# Altium schematic sheet TOP - NAATOS INLAY.SchDoc
size A; Revision: 8; SheetNumber: 1; SheetTotal: 7
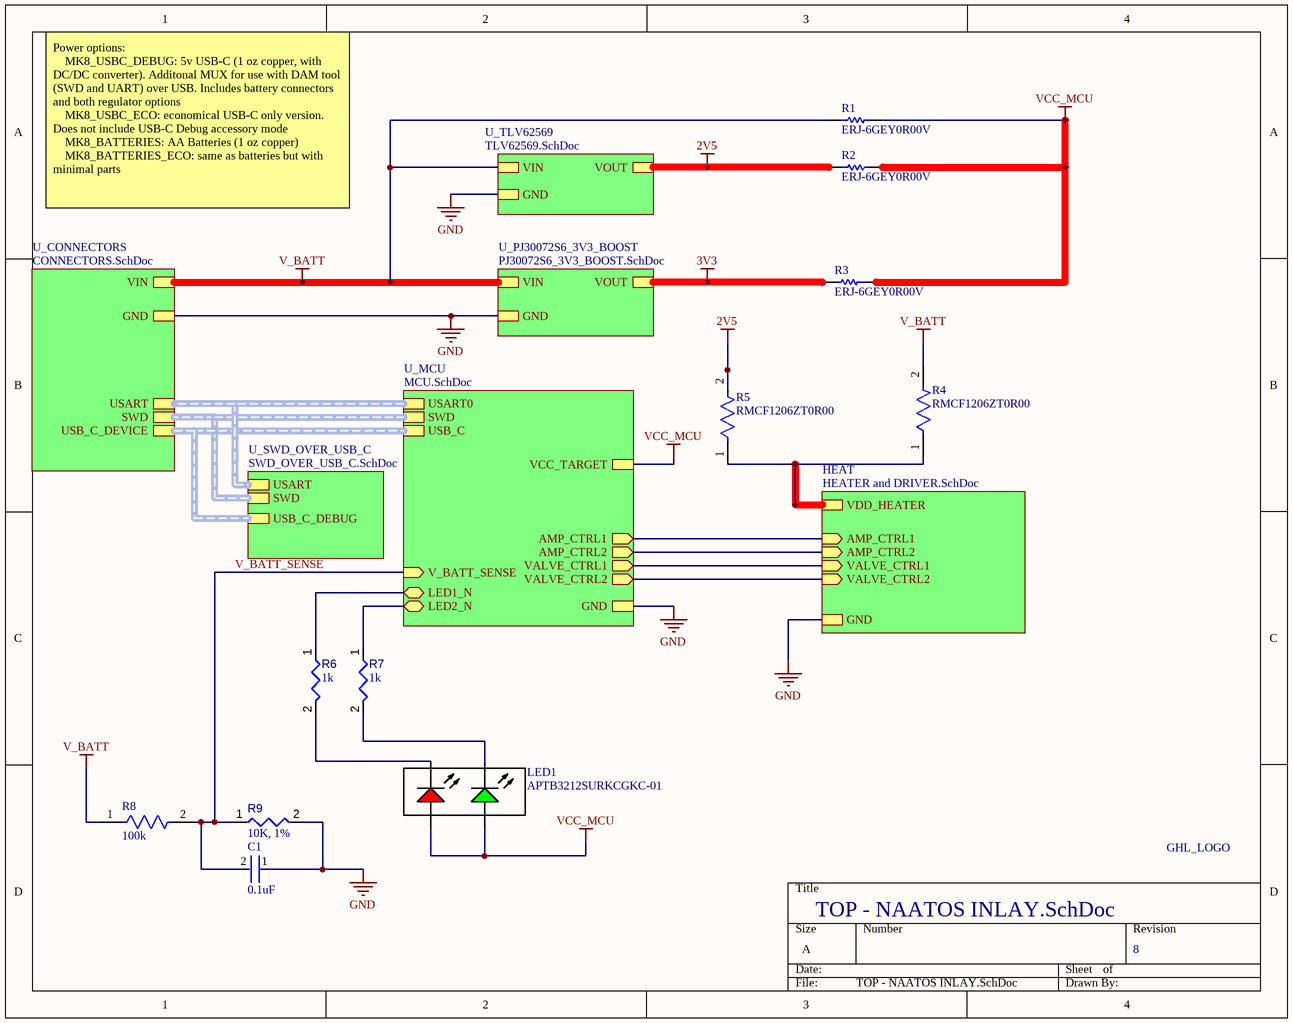
[diagram p0: TOP - NAATOS INLAY.SchDoc]

## Parts
C1  0.1uF  [FP-CL17-IPC_C]
LED1  APTB3212SURKCGKC-01  [APTB3212SURKCGKC-01]
LOGO1  GHL_LOGO  [GHLABS_LOGO]
R1  ERJ-6GEY0R00V  [RESC2013X70X40NL20T20]
R2  ERJ-6GEY0R00V  [RESC2013X70X40NL20T20]
R3  ERJ-6GEY0R00V  [RESC2013X70X40NL20T20]
R4  RMCF1206ZT0R00  [FP-RMCF1206-MFG]
R5  RMCF1206ZT0R00  [FP-RMCF1206-MFG]
R6  value 1k  [RESC1608X55X25ML10T15]  (hidden comment: Resistor 1k +/-1% 0603 100 mW)
R7  value 1k  [RESC1608X55X25ML10T15]  (hidden comment: Resistor 1k +/-1% 0603 100 mW)
R8  Resistance: 100k  [FP-CRCW0402-e3-IPC_C]  (hidden comment: CRCW0402100KFKED)
R9  value 10K, 1%  [RESC0402(1005)_L]  (hidden comment: Resistor 10K  +/-1 % 0402 63 mW)

## Sub-sheets
HEAT = HEATER and DRIVER.SchDoc: GND, VDD_HEATER, AMP_CTRL1 (in), VALVE_CTRL1 (in), AMP_CTRL2 (in), VALVE_CTRL2 (in)
U_CONNECTORS = CONNECTORS.SchDoc: GND, USART (harness USART), VIN, USB_C_DEVICE (harness USB_C), SWD (harness SWD)
U_MCU = MCU.SchDoc: USART0 (harness USART), VCC_TARGET, GND, AMP_CTRL1 (out), AMP_CTRL2 (out), VALVE_CTRL1 (out), VALVE_CTRL2 (out), V_BATT_SENSE (in), LED1_N (bidir), LED2_N (bidir), SWD (harness SWD), USB_C (harness USB_C)
U_PJ30072S6_3V3_BOOST = PJ30072S6_3V3_BOOST.SchDoc: VIN, GND, VOUT
U_SWD_OVER_USB_C = SWD_OVER_USB_C.SchDoc: USB_C_DEBUG (harness USB_C), SWD (harness SWD), USART (harness USART)
U_TLV62569 = TLV62569.SchDoc: VOUT, VIN, GND

## Nets
2V5: R2.1 R5.2 ; sheet U_TLV62569/VOUT
3V3: R3.1 ; sheet U_PJ30072S6_3V3_BOOST/VOUT
GND: C1.1 R9.2 ; sheet HEAT/GND, sheet U_CONNECTORS/GND, sheet U_MCU/GND, sheet U_TLV62569/GND, sheet U_PJ30072S6_3V3_BOOST/GND
V_BATT: R1.1 R4.2 R8.1 ; sheet U_CONNECTORS/VIN, sheet U_TLV62569/VIN, sheet U_PJ30072S6_3V3_BOOST/VIN
VCC_MCU: LED1.2(A) LED1.3(A) R1.2 R2.2 R3.2 ; sheet U_MCU/VCC_TARGET
V_BATT_SENSE: C1.2 R8.2 R9.1 ; sheet U_MCU/V_BATT_SENSE
NetLED1_1: LED1.1(K) R6.2
NetLED1_4: LED1.4(K) R7.2
NetR4_1: R4.1 R5.1 ; sheet HEAT/VDD_HEATER
NetR6_1: R6.1 ; sheet U_MCU/LED1_N
NetR7_1: R7.1 ; sheet U_MCU/LED2_N
(unnamed): sheet HEAT/AMP_CTRL1, sheet U_MCU/AMP_CTRL1
(unnamed): sheet HEAT/VALVE_CTRL1, sheet U_MCU/VALVE_CTRL1
(unnamed): sheet HEAT/AMP_CTRL2, sheet U_MCU/AMP_CTRL2
(unnamed): sheet HEAT/VALVE_CTRL2, sheet U_MCU/VALVE_CTRL2

## Buses and harness runs
harness sheet U_CONNECTORS/SWD = sheet U_MCU/SWD = sheet U_SWD_OVER_USB_C/SWD
harness sheet U_CONNECTORS/USART = sheet U_MCU/USART0 = sheet U_SWD_OVER_USB_C/USART
harness sheet U_CONNECTORS/USB_C_DEVICE = sheet U_MCU/USB_C = sheet U_SWD_OVER_USB_C/USB_C_DEBUG

## Notes on the sheet
- Power options:
  MK8_USBC_DEBUG: 5v USB-C (1 oz copper, with DC/DC converter). Additonal MUX for use with DAM tool (SWD and UART) over USB. Includes battery connectors and both regulator options
  MK8_USBC_ECO: economical USB-C only version. Does not include USB-C Debug accessory mode
  MK8_BATTERIES: AA Batteries (1 oz copper)
  MK8_BATTERIES_ECO: same as batteries but with minimal parts

## Library data of the parts
C1 = CMP-13271-001069-1: Cap Ceramic 100nF 10V X7R ±10% SMD 0402 +125°C Paper T/R; Height: 0.5mm; Case/Package: 0402; Contact Plating: Tin; Case Code (Imperial): 0402; Capacitance: 100nF; Thickness: 0.022inch; Min Operating Temperature: -55°C; Package Quantity: 1; Length: 1mm; Max Operating Temperature: 125°C; Depth: 0.5mm; Voltage Rating: 10V; Packaging: Tape and Reel; Mount: Surface Mount; Tolerance: 10%; Width: 0.02inch; Radiation Hardening: No; Case Code (Metric): 1005; Dielectric: X7R
LED1 = APTB3212SURKCGKC-01: Dual Color LED; Manufacturer: Kingbright; Supplier: Mouser; Supplier Part Number: 604-APTB3212SURKCGKC; Manufacturer Part Number: APTB3212SURKCGKC-01; RoHS: Yes; Category: LEDs; Stock: 2181; Pricing: 1=0.59, 10=0.409, 50=0.409, 100=0.295, 500=0.243, 1000=0.226, 2000=0.222, 4000=0.195, 10000=0.18, 24000=0.173 (USD); RoHS Compliant: Yes; ComponentLink1URL: https://datasheet.ciiva.com:443/pdfs/VipMasterIC/IC/KBEC/KBEC-S-A0008946974/KBEC-S-A0008946997-1.pdf?src-supplier=IHS+Markit; ComponentLink1Description: https://datasheet.ciiva.com:443/pdfs/VipMasterIC/IC/KBEC/KBEC-S-A0008946974/KBEC-S-A0008946997-1.pdf?src-supplier=IHS+Markit; Supplier 1: Digikey; Supplier Part Number 1: 754-APTB3212SURKCGKC-01CT-ND
LOGO1 = CMP-439-000000-1: Design Item ID: GHL_LOGO; Source: GHLABS_LOGO.SchLib
R1-R3 = CMP-1665-00002-5: Chip Resistor, 0 Ohm, +/- 1%, 0.125 W, -55 to 155 degC, 0805 (2012 Metric), RoHS, Tape and Reel; Tolerance: 5%; Resistance: 0 Ohm; REACH SVHC: No SVHC; Min Operating Temperature: -55 degC; Case/Package: 0805; Packaging: Tape and Reel; Package Quantity: 5000; ComponentLink1Description: Manufacturer URL; PackageDescription: 2-Pin Surface Mount Device, Body 2 x 1.25 mm; Mounting Technology: Surface Mount; Max Operating Temperature: 155 degC; PartNumber: ERJ-6GEY0R00V; Width: 1.25 mm; RoHSCompliant: True; Height: 0.6 mm; ComponentLink1URL: http://www.panasonic.com/; ComponentLink2URL: http://industrial.panasonic.com/cdbs/www-data/pdf/RDA0000/AOA0000C84.pdf; Case Code (Imperial): 0805; DatasheetVersion: 03/2015; Length: 2 mm; Case Code (Metric): 2012; ComponentLink2Description: Datasheet; Radiation Hardening: No
R4 R5 = CMP-26527-005649-1: 0Ω ±0 0.25W 1206 Thick Film Chip Resistor AEC-Q200 compliant; Working Voltage: 200V; Power Rating: 250mW; Current Rating: 2A; Resistance: 0R; Construction: Rectangular; RoHS Compliant: Yes; Military Standard: Not; Radiation Hardening: No; Case/Package: 1206; Case Code (Imperial): 1206; Packaging: Tape and Reel; Resistor Type: Thick Film; Mount: Surface Mount; Lead Free: Lead Free; Case Code (Metric): 3216; Width: 0.063inch; Series: RMCF; Features: Automotive AEC-Q200; Number of Terminations: 2; Min Operating Temperature: -55°C; Max Power Dissipation: 250mW; Contact Plating: Tin; Length: 0.126inch; Height: 0.028inch; Technology: THICK FILM; Max Operating Temperature: 155°C; Depth: 1.6mm
R6 R7 = CMP-009-00014-4: Chip Resistor, 1 KOhm, +/-1%, 0.1 W, -55 to 155 degC, 0603 (1608 Metric); Power: 100mW; Tolerance: 1%; Voltage Rating: 50V; Max Operating Temperature: 155°C; Pins: 2; RoHS Compliant: True; Case/Package: 0603; Min Operating Temperature: -55°C; Mounting Technology: SM
R8 = CMP-2002-08123-3: RES Thick Film, 100kΩ, 1%, 0.063W, 100ppm/°C, 0402; Power Rating: 63mW; Voltage Rating (DC): 50V; Lead Free: Lead Free; Height: 0.35mm; Contact Plating: Tin; Min Operating Temperature: -55°C; Package Quantity: 10000; Case/Package: 0402; Temperature Coefficient: 100ppm/°C; Number of Terminations: 2; Packaging: Tape and Reel; Max Power Dissipation: 63mW; Case Code (Metric): 1005; Mount: Surface Mount; Width: 0.02inch; Termination: SMD/SMT; Length: 1mm; Number of Pins: 2; Weight: 2.3E-05oz; Radiation Hardening: No; Tolerance: 1%; Military Standard: Not; Features: Automotive AEC-Q200; Depth: 0.5mm; Composition: Thick Film; Max Operating Temperature: 155°C; Voltage Rating: 50V; Case Code (Imperial): 0402
R9 = CMP-009-00149-2: Chip Resistor, 10 kOhms, +/-1 %, 63 mW, -55 to 125 degC, 0402; Power: 63mW; Tolerance: 1%; Pins: 2; Max Operating Temperature: 155°C; Min Operating Temperature: -55°C; Case/Package: 0402